# Altium project eye_tracking_wheelchair.PrjPcb
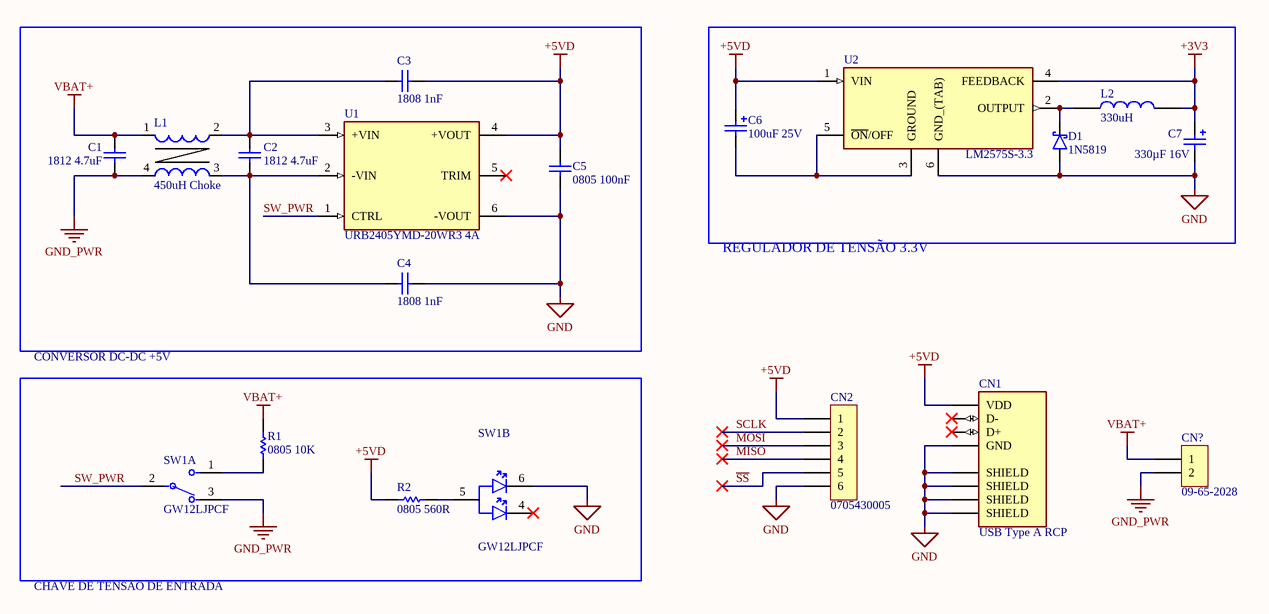
[diagram p0: power_module.SchDoc]
1 sheet, 18 parts. Net scope: global (net labels, ports and power ports of the same name join across sheets).

## Sheet power_module.SchDoc: Módulo de Alimentação
size A4; Engineer: Amós Nunes; Organization: NUTES; SheetNumber: 1; SheetTotal: 1; Tamanho: A4; Equipament: E. T. Wheelchair

### Parts
C1  1812 4.7uF  [CAP1812]
C2  1812 4.7uF  [CAP1812]
C3  1808 1nF  [CAP1808]
C4  1808 1nF  [CAP1808]
C5  0805 100nF  [CAP0805]
C6  100uF 25V  [CAP_PK/PZ_6P3X11_LOW_RUB]
C7  330µF 16V  [CAP_PK/PZ_6P3X11_LOW_RUB]
CN1  USB Type A RCP  [MOLEX_48258-0001]
CN2  0705430005  [FP-0705430005-MFG]
CN?  09-65-2028  [FP-09-65-2028-MFG]
D1  1N5819  [DIOAD1405W86L465D235]
L1  450uH Choke  [WE-CMB-HC-S]
L2  330uH  [CLF7045_*]
R1  0805 10K  [RES0805]
R2  0805 560R  [RES0805]
SW1  GW12LJPCF  [FP-GW12LJPCF-MFG]  (parts A,B of 2)
U1  URB2405YMD-20WR3 4A  [CONV_URB2405YMD-20WR3]
U2  LM2575S-3.3  [TO170P1435X465-6N]

### Blocks framed on the sheet
CONVERSOR DC-DC +5V: R1 R2 SW1

### Nets
+3V3: C7.1 L2.2 U2.4(FEEDBACK)
+5VD: C3.2 C5.1 C6.1 CN1.1(VDD) CN2.1 R2.1 U1.4(+VOUT) U2.1(VIN)
GND: C4.1 C5.2 C7.2 CN1.4(GND) CN1.SH1(SHIELD) CN1.SH2(SHIELD) CN1.SH3(SHIELD) CN1.SH4(SHIELD) CN2.6 D1.2(A) SW1.6(GREEN_C) U1.6(-VOUT) U2.6(GND_(TAB))
GND_PWR: C1.2 CN?.2 L1.4 SW1.3
VBAT+: C1.1 CN?.1 L1.1 R1.1
~{SS}: CN2.5
MISO: CN2.4
MOSI: CN2.3
SCLK: CN2.2
SW_PWR: SW1.2(COM) U1.1(CTRL)
NetC2_1: C2.1 C3.1 L1.2 U1.3(+VIN)
NetC2_2: C2.2 C4.2 L1.3 U1.2(-VIN)
NetC6_2: C6.2 U2.3(GROUND) U2.5(~{ON}/OFF)
NetD1_1: D1.1(K) L2.1 U2.2(OUTPUT)
NetR1_2: R1.2 SW1.1
NetR2_2: R2.2 SW1.5(COMMON_ANODE)

Not connected (* = marked no-connect by the designer): CN1 2(D-)* 3(D+)*; SW1 4(RED_C)*; U1 5(TRIM)*

### Notes on the sheet
- REGULADOR DE TENSÃO 3.3V
- CHAVE DE TENSÃO DE ENTRADA
- Title
- Size:
- Date:
- Equipament:
- Draw By:
- Sheet:
- Board:
- of:
- File:

### Library data of the parts
C1 C2 = C1812C475K5RACAUTO: Cap Ceramic 4.7uF 50V X7R 10% Pad SMD 1812 125C Automotive T/R; Manufacturer: KEMET; Supplier 1: Newark; Manufacturer Part Number: C1812C475K5RACAUTO; RoHS: Yes; Category: Ceramic Capacitors; Stock 1: 5654; Pricing 1: 1=2,33000, 10=2,16000, 25=2,00000, 50=1,83000, 100=1,66000 (USD); Mount: Surface Mount; Case/Package: 1812; Case Code (Metric): 4532; Case Code (Imperial): 1812; Dielectric Material: Ceramic; Min Operating Temperature: -55°C; Max Operating Temperature: 125°C; Package Quantity: 1; Capacitance: 4.7uF; Voltage Rating: 50V; Tolerance: 10%; Packaging: Cut Tape; Voltage Rating (DC): 50V; Series: C; Dielectric: X7R; Length: 0.177inch; Width: 0.126inch; Thickness: 0.071inch; Depth: 3.2mm; Ratings: AEC-Q200; RoHS Compliant: Yes; REACH SVHC: No SVHC; ComponentLink1URL: https://datasheet.ciiva.com/6256/datasheetpn-c1812c475k5racauto-6256279.pdf?src-supplier=Digi-Key; ComponentLink1Description: https://datasheet.ciiva.com/6256/datasheetpn-c1812c475k5racauto-6256279.pdf?src-supplier=Digi-Key; ComponentLink2URL: https://datasheet.ciiva.com/7807/1698758-7807389.pdf?src-supplier=Element14; ComponentLink2Description: https://datasheet.ciiva.com/7807/1698758-7807389.pdf?src-supplier=Element14; Supplier Part Number 1: 86T2696
C3 C4 = C1808C102KGRACTU: 1808 C 1nF Ceramic Multilayer Capacitor; 2000 VDC; +125degC; X7R Dielec; +/-10%; Manufacturer: KEMET; Tolerance: 10%; Voltage Rating: 2kV; Voltage Rating (DC): 2.5kV; Dissipation Factor: 2.5%; Supplier 1: Newark; Manufacturer Part Number: C1808C102KGRACTU; RoHS: Yes; Category: Ceramic Capacitors; Stock 1: 3288; Pricing 1: 1=1,63000, 10=1,16000, 25=1,01000, 50=0,86800, 100=0,72300 (USD); Mount: Surface Mount,PCB; Case/Package: 1808; Number of Pins: 2; Case Code (Metric): 4520; Case Code (Imperial): 1808; Dielectric Material: Ceramic; Min Operating Temperature: -55°C; Max Operating Temperature: 125°C; Dielectric: X7R; Capacitance: 1nF; Package Quantity: 1000; Packaging: Tape and Reel; Termination: SMD/SMT; Voltage: 2kV; Series: C; Length: 4.7mm; Width: 0.079inch; Height: 1.6mm; Thickness: 0.069inch; Depth: 2mm; Radiation Hardening: No; REACH SVHC: No SVHC; RoHS Compliant: Yes; ComponentLink1URL: https://datasheet.ciiva.com/148/docfinderpartnumber-c1808c102kgractu-148948.pdf?src-supplier=Digi-Key; ComponentLink1Description: https://datasheet.ciiva.com/148/docfinderpartnumber-c1808c102kgractu-148948.pdf?src-supplier=Digi-Key; ComponentLink2URL: https://datasheet.ciiva.com/5420/kem-c1010-x7r-hv-smd-5420520.pdf?src-supplier=Mouser; ComponentLink2Description: https://datasheet.ciiva.com/5420/kem-c1010-x7r-hv-smd-5420520.pdf?src-supplier=Mouser; Supplier Part Number 1: 50AC8501
C5 = CC0805KRX7R9BB104: CC Series 0805 0.1 uF 50 V ±10 % Tolerance X7R SMT Multilayer Ceramic Capacitor; Manufacturer: Yageo; Tolerance: 10%; Voltage Rating: 50V; Insulation Resistance: 100GR; Supplier 1: Digi-Key; Manufacturer Part Number: CC0805KRX7R9BB104; RoHS: Yes; Category: Ceramic Capacitors; Stock 1: 7319595; Pricing 1: 4000=0,01864, 8000=0,01734 (USD); Mount: Surface Mount; Case/Package: 0805; Number of Pins: 2; Case Code (Metric): 2012; Case Code (Imperial): 0805; Material: Ceramic; Min Operating Temperature: -55°C; Max Operating Temperature: 125°C; Capacitance: 100nF; Dielectric: X7R; Packaging: Tape and Reel; Package Quantity: 1; Termination: SMD/SMT; Voltage: 50V; Series: CC; Length: 2mm; Width: 0.049inch; Height: 0.85mm; Depth: 1.25mm; Thickness: 0.033inch; Radiation Hardening: No; REACH SVHC: No SVHC; Lead Free: Lead Free; Halogen Free: Halogen Free; RoHS Compliant: Yes; ComponentLink1URL: https://datasheet.ciiva.com/11786/0900766b80d84f1d-11786009.pdf?src-supplier=RSComponents; ComponentLink1Description: https://datasheet.ciiva.com/11786/0900766b80d84f1d-11786009.pdf?src-supplier=RSComponents; ComponentLink2URL: https://datasheet.ciiva.com/155/mlccorderingcode-155929.pdf?src-supplier=Digi-Key; ComponentLink2Description: https://datasheet.ciiva.com/155/mlccorderingcode-155929.pdf?src-supplier=Digi-Key; ComponentLink3URL: https://datasheet.ciiva.com/155/mlccorderingcode-155930.pdf?src-supplier=Digi-Key; ComponentLink3Description: https://datasheet.ciiva.com/155/mlccorderingcode-155930.pdf?src-supplier=Digi-Key; ComponentLink4URL: https://datasheet.ciiva.com/155/mlccorderingcode-155931.pdf?src-supplier=Digi-Key; ComponentLink4Description: https://datasheet.ciiva.com/155/mlccorderingcode-155931.pdf?src-supplier=Digi-Key; ComponentLink5URL: https://datasheet.ciiva.com/11464/upy-gphc-x7r-6-3v-to-50v-8-11464757.pdf?src-supplier=Avnet; ComponentLink5Description: https://datasheet.ciiva.com/11464/upy-gphc-x7r-6-3v-to-50v-8-11464757.pdf?src-supplier=Avnet; ComponentLink6URL: https://datasheet.ciiva.com/16625/upy-gphc-x7r-6-3v-to-50v-8-16625549.pdf?src-supplier=Avnet+Europe; ComponentLink6Description: https://datasheet.ciiva.com/16625/upy-gphc-x7r-6-3v-to-50v-8-16625549.pdf?src-supplier=Avnet+Europe; ComponentLink7URL: https://datasheet.ciiva.com/28450/1489800-28450805.pdf?src-supplier=Element14; ComponentLink7Description: https://datasheet.ciiva.com/28450/1489800-28450805.pdf?src-supplier=Element14; ComponentLink8URL: https://datasheet.ciiva.com/46393/1734573-46393307.pdf?src-supplier=Element14; ComponentLink8Description: https://datasheet.ciiva.com/46393/1734573-46393307.pdf?src-supplier=Element14; ComponentLink9URL: https://datasheet.ciiva.com/29242/445210-da-01-en-kerko-chip-0805-x7r-0-1uf-10proz-50vg-29242074.pdf?src-supplier=Conrad; ComponentLink9Description: https://datasheet.ciiva.com/29242/445210-da-01-en-kerko-chip-0805-x7r-0-1uf-10proz-50vg-29242074.pdf?src-supplier=Conrad; Supplier Part Number 1: 311-1140-2-ND
C6 = 25YXF100MEFC6.3X11: 100 µF 25 V Aluminum Electrolytic Capacitors Radial, Can - 5000 Hrs @ 105°C; Manufacturer_Name: Rubycon; Supplier 1: Digi-Key; Supplier Part Number 1: 1189-1857-ND; MP: 25YXF100MEFC6.3X11
C7 = 16PK330MEFC6.3X11: Cap Aluminum 330uF 16V 20% (6.3 X 11mm) Radial Aluminum Cylindrical Can 2.5mm 360mA 2000 hr 85°C Bulk; Mfr_Name: Rubycon; Type: DEV; Life (Hours): 2000Hour; Leakage Current: 3uA; Lead Diameter: 0.5mm; Copyright: Copyright (C) 2021 Ultra Librarian. All rights reserved.; Manufacturer_Part_Number: 16PK330MEFC6.3X11; Digi-Key_Part_Number_1: 1189-1122-ND; RefDes: RefDes; Supplier 1: Newark; Manufacturer: Rubycon; Manufacturer Part Number: 16PK330MEFC6.3X11; RoHS: Yes; Category: Aluminum Electrolytic Capacitors; Stock 1: 1848; Pricing 1: 1=0,04600, 10=0,04600, 25=0,04600, 50=0,04600, 100=0,04600, 500=0,04600 (USD); Mount: Through Hole; Case/Package: Radial; Number of Pins: 2; Min Operating Temperature: -40°C; Max Operating Temperature: 85°C; Capacitance: 330uF; Tolerance: 20%; Ripple Current: 360mA; Termination: Radial; Voltage Rating: 16V; Ripple Current (AC): 360mA; Package Quantity: 2000; Packaging: Bulk; Voltage: 16V; Voltage Rating (DC): 16V; Series: PK; Construction: RADIAL; Diameter: 6.3mm; Height: 11mm; Lead Pitch: 2.5mm; Height - Seated (Max): 0.492inch; Radiation Hardening: No; REACH SVHC: No SVHC; RoHS Compliant: Yes; ComponentLink1URL: https://datasheet.ciiva.com/25614/0900766b810f8819-25614366.pdf?src-supplier=RSComponents; ComponentLink1Description: https://datasheet.ciiva.com/25614/0900766b810f8819-25614366.pdf?src-supplier=RSComponents; ComponentLink2URL: https://datasheet.ciiva.com/11690/e-pk-11690815.pdf?src-supplier=Avnet; ComponentLink2Description: https://datasheet.ciiva.com/11690/e-pk-11690815.pdf?src-supplier=Avnet; ComponentLink3URL: https://datasheet.ciiva.com/6328/e-pk-6328463.pdf?src-supplier=Digi-Key; ComponentLink3Description: https://datasheet.ciiva.com/6328/e-pk-6328463.pdf?src-supplier=Digi-Key; Supplier Part Number 1: 39T8550
CN1 = 48258-0001: Conn USB Type A RCP 4 POS 2.5mm Solder RA Thru-Hole 4 Terminal 1 Port Embossed T/R; Manufacturer Part Number: 0482580001; MF: Molex; Number of Terminals/Pins: 4; Gender: Receptacle; Number of Ports: 1; Max Voltage Rating (AC): 250V; Value: *; MP: 48258-0001; Package: None; Price: None; SnapEDA_Link: https://www.snapeda.com/parts/48258-0001/Molex/view-part/337624/?ref=snap; Availability: Unavailable; Supplier 1: Newark; Manufacturer: Molex; RoHS: Yes; Category: Headers and Wire Housings; Stock 1: 1047; Pricing 1: 1=1,29000, 10=1,08000, 25=0,99800, 50=0,91400, 100=0,83000 (USD); Mount: Through Hole,Board; Contact Material: Bronze; Contact Plating: Gold,Tin; Housing Material: Polyamide; Min Operating Temperature: -25°C; Max Operating Temperature: 85°C; Packaging: Tape and Reel; Connector Type: USB; Number of Contacts: 4; Termination: Solder; Orientation: Right Angle; Series: 48258; Package Quantity: 1; Length: 17.1mm; Pitch: 2.5mm; Depth: 14mm; ComponentLink1URL: https://datasheet.ciiva.com/851/482580001-sd-851811.pdf?src-supplier=Digi-Key; ComponentLink1Description: https://datasheet.ciiva.com/851/482580001-sd-851811.pdf?src-supplier=Digi-Key; ComponentLink2URL: https://datasheet.ciiva.com/3094/0482580001-io-connectors-3094328.pdf?src-supplier=Avnet; ComponentLink2Description: https://datasheet.ciiva.com/3094/0482580001-io-connectors-3094328.pdf?src-supplier=Avnet; ComponentLink3URL: https://datasheet.ciiva.com/851/482580001-sd-851812.pdf?src-supplier=Digi-Key; ComponentLink3Description: https://datasheet.ciiva.com/851/482580001-sd-851812.pdf?src-supplier=Digi-Key; ComponentLink4URL: https://datasheet.ciiva.com/15181/getdatasheetpartid-434363-15181356.pdf?src-supplier=Verical; ComponentLink4Description: https://datasheet.ciiva.com/15181/getdatasheetpartid-434363-15181356.pdf?src-supplier=Verical; Supplier Part Number 1: 74AC2928
CN2 = 0705430005: Conn Shrouded Header (4 Sides) HDR 6 POS 2.54mm Solder ST Top Entry Thru-Hole SL™ Tube; Manufacturer: Molex; Contact Resistance: 30mR; Number of Positions: 6; Connector Type: Male Pin; Pitch: 0.1inch; Supplier 1: RSComponents; Manufacturer Part Number: 0705430005; RoHS: Yes; Category: Headers and Wire Housings; Stock 1: 440; Pricing 1: 10=1,32100, 200=1,15000, 750=0,92500, 3000=0,75400, 6000=0,73000 (USD); Mount: Through Hole; Contact Plating: Gold; Contact Material: Bronze; Color: Black; Housing Color: Black; Housing Material: Polyester; Min Operating Temperature: -40°C; Max Operating Temperature: 105°C; Packaging: Rail/Tube; Number of Rows: 1; Termination: Solder; Orientation: Straight; Series: C-Grid® SL™ 70543; Contact Type: Male Pin; Length: 17.79mm; Depth: 6.6mm; Contact Mating Length: 0.24inch; Radiation Hardening: No; RoHS Compliant: Yes; ComponentLink1URL: http://components.arrow.com/part/dataview/2934603S3153303N3303?src-supplier=Arrow+Electronics; ComponentLink1Description: http://components.arrow.com/part/dataview/2934603S3153303N3303?src-supplier=Arrow+Electronics; ComponentLink2URL: http://components.arrow.com/part/dataview/0323_00048382?src-supplier=Arrow+Europe; ComponentLink2Description: http://components.arrow.com/part/dataview/0323_00048382?src-supplier=Arrow+Europe; Supplier Part Number 1: 6792483
CN? = 09-65-2028: Manufacturer: MolexProduct Category: Headers & Wire HousingsBrand: MolexProduct: HeadersType: Pin StripNumber of...; Manufacturer: Molex; Number of Contacts: 2; Gender: Male; Contact Resistance: 10mR; Max Voltage Rating (AC): 250V; Current Rating: 7A; Insulation Resistance: 50GR; Pitch: 3.96mm; Supplier 1: RSComponents; Manufacturer Part Number: 09-65-2028; RoHS: Yes; Category: Headers and Wire Housings; Stock 1: 1; Pricing 1: 10=0,29200, 100=0,26200, 250=0,23700, 500=0,21400, 1000=0,19200 (USD); Mount: Through Hole; Contact Plating: Tin,Copper; Contact Material: Brass; Housing Material: Nylon; Housing Color: Natural; Color: Natural; Min Operating Temperature: -40°C; Max Operating Temperature: 105°C; Number of Rows: 1; Termination: Solder; Voltage Rating: 250V; Package Quantity: 12000; Packaging: Bulk; Number of Positions: 2; Orientation: Straight; Voltage Rating (DC): 250V; Fastening Type: Friction; Series: SPOX™ 5273; Contact Type: Male Pin; Contact Mating Length: 0.419inch; Depth: 10.75mm; Radiation Hardening: No; Lead Free: Lead Free; RoHS Compliant: Yes; REACH SVHC: Unknown; Flammability Rating: UL94 V-2; ComponentLink1URL: https://datasheet.ciiva.com/5157/0009652028-pcb-headers-156612-5157782.pdf?src-supplier=Mouser; ComponentLink1Description: https://datasheet.ciiva.com/5157/0009652028-pcb-headers-156612-5157782.pdf?src-supplier=Mouser; ComponentLink2URL: https://datasheet.ciiva.com/11746/0900766b80d59e72-11746663.pdf?src-supplier=RSComponents; ComponentLink2Description: https://datasheet.ciiva.com/11746/0900766b80d59e72-11746663.pdf?src-supplier=RSComponents; ComponentLink3URL: https://datasheet.ciiva.com/30186/71930009652028-pcb-headers-30186738.pdf?src-supplier=Onlinecomponents.com; ComponentLink3Description: https://datasheet.ciiva.com/30186/71930009652028-pcb-headers-30186738.pdf?src-supplier=Onlinecomponents.com; ComponentLink4URL: https://datasheet.ciiva.com/10088/0009652028-pcb-headers-10088443.pdf?src-supplier=Avnet; ComponentLink4Description: https://datasheet.ciiva.com/10088/0009652028-pcb-headers-10088443.pdf?src-supplier=Avnet; ComponentLink5URL: https://datasheet.ciiva.com/15217/getdatasheetpartid-176740-15217269.pdf?src-supplier=Verical; ComponentLink5Description: https://datasheet.ciiva.com/15217/getdatasheetpartid-176740-15217269.pdf?src-supplier=Verical; Supplier Part Number 1: 6705237P
D1 = 1N5819: Schottky Diode, DO-15, 40V, 1.00A; Manufacturer_Name: MDD; Manufacturer: ON Semiconductor / Fairchild; Element Configuration: Single; Peak Non-Repetitive Surge Current: 25A; Forward Voltage: 900mV; Forward Current: 1A; Max Reverse Current: 500uA; Polarity: Standard; Capacitance: 110pF; Max Reverse Leakage Current: 1mA; Datasheet Link: https://datasheet.lcsc.com/szlcsc/1903051130_MDD-Jiangsu-Yutai-Elec-1N5819_C2474.pdf; Manufacturer_Part_Number: 1N5819; Supplier 1: Avnet; Manufacturer Part Number: 1N5819; RoHS: Yes; Category: Schottky Diodes; Mount: Through Hole; Case/Package: DO-41; Number of Pins: 2; Contact Plating: Tin,Matte; Weight: 0.245g; Min Operating Temperature: -65°C; Max Operating Temperature: 125°C; Packaging: Tape and Reel; Package Quantity: 5000; Max Repetitive Reverse Voltage (Vrrm): 40V; Voltage Rating (DC): 40V; Series: -; Average Rectified Current: 1A; Current Rating: 1A; Output Current: 1A; Max Reverse Voltage (DC): 40V; Max Forward Surge Current (Ifsm): 25A; Max Surge Current: 25A; Diameter: 2.72mm; Length: 5.2mm; Width: 2.72mm; Height: 2.72mm; Radiation Hardening: No; RoHS Compliant: Yes; Lead Free: Lead Free; REACH SVHC: No SVHC; ComponentLink1URL: https://datasheet.ciiva.com/34302/1200637-34302074.pdf?src-supplier=Jameco; ComponentLink1Description: https://datasheet.ciiva.com/34302/1200637-34302074.pdf?src-supplier=Jameco; ComponentLink2URL: https://datasheet.ciiva.com/4719/1n5817-d-103200-4719059.pdf?src-supplier=Mouser; ComponentLink2Description: https://datasheet.ciiva.com/4719/1n5817-d-103200-4719059.pdf?src-supplier=Mouser; ComponentLink3URL: https://datasheet.ciiva.com/25951/1n5819-25951350.pdf?src-supplier=Avnet+Europe; ComponentLink3Description: https://datasheet.ciiva.com/25951/1n5819-25951350.pdf?src-supplier=Avnet+Europe; ComponentLink4URL: https://datasheet.ciiva.com/1177/1671052-1177084.pdf?src-supplier=Element14; ComponentLink4Description: https://datasheet.ciiva.com/1177/1671052-1177084.pdf?src-supplier=Element14; ComponentLink5URL: https://datasheet.ciiva.com/8300/1n5819-8300426.pdf?src-supplier=Avnet; ComponentLink5Description: https://datasheet.ciiva.com/8300/1n5819-8300426.pdf?src-supplier=Avnet; ComponentLink6URL: https://datasheet.ciiva.com/22651/1671052-22651942.pdf?src-supplier=Element14; ComponentLink6Description: https://datasheet.ciiva.com/22651/1671052-22651942.pdf?src-supplier=Element14; Supplier Part Number 1: 1N5819
L1 = 7448227005: Choke/Filter, Common Mode, WE-CMB Size S HC . .45mH 6.5A 10mOhm; Manufacturer: Wurth Electronics; Number of Lines: 2; Tolerance: 30%; Resistance: 0.01R; DC Resistance (DCR): 10mR; Test Frequency: 50Hz; Lead Diameter: 1mm; Supplier 1: RSComponents; Manufacturer Part Number: 7448227005; RoHS: Yes; Category: Common Mode Chokes; Stock 1: 1; Pricing 1: 1=7,14100, 10=6,95300, 100=5,27200, 250=5,12400, 500=4,96300 (USD); Mount: Through Hole,Radial; Min Operating Temperature: -40°C; Max Operating Temperature: 125°C; Package Quantity: 80; Packaging: Tray; Inductance: 450uH; Current: 6.5A; Max DC Current: 6.5A; Termination: Radial; Series: WE-CMB HC; Length: 18.5mm; Width: 14.5mm; Height: 22mm; Lead Pitch: 5mm; Depth: 14.5mm; RoHS Compliant: Yes; ComponentLink1URL: https://datasheet.ciiva.com/6216/7448227005-6216296.pdf?src-supplier=Digi-Key; ComponentLink1Description: https://datasheet.ciiva.com/6216/7448227005-6216296.pdf?src-supplier=Digi-Key; ComponentLink2URL: https://datasheet.ciiva.com/11796/0900766b80f88bbf-11796059.pdf?src-supplier=RSComponents; ComponentLink2Description: https://datasheet.ciiva.com/11796/0900766b80f88bbf-11796059.pdf?src-supplier=RSComponents; Supplier Part Number 1: 7362134P
L2 = CLF7045NIT-331M-D: Inductor Power Shielded Wirewound 330uH 20% 100KHz Ferrite 580mA 800mOhm DCR Automotive T/R; Manufacturer_Name: TDK; Saturation Current: 500mA; DC Resistance (DCR): 960mR; Datasheet Link: https://product.tdk.com/system/files/dam/doc/product/inductor/inductor/smd/catalog/inductor_automotive_power_clf7045ni-d_en.pdf; Manufacturer_Part_Number: CLF7045NIT-331M-D; Mouser Part Number: 810-CLF7045NIT331MD; Mouser Price/Stock: https://www.mouser.co.uk/ProductDetail/TDK/CLF7045NIT-331M-D?qs=P8zzrVhehavOPOXOSviaZQ%3D%3D; Arrow Part Number: CLF7045NIT-331M-D; Arrow Price/Stock: https://www.arrow.com/en/products/clf7045nit-331m-d/tdk; Supplier 1: Digi-Key; Manufacturer: TDK; Manufacturer Part Number: CLF7045NIT-331M-D; RoHS: Yes; Category: Fixed Inductors; Stock 1: 29828; Pricing 1: 1=1,24000, 10=1,14800, 25=1,05920, 50=0,88280, 100=0,82980, 250=0,74152, 500=0,63558 (USD); Mount: Surface Mount; Case/Package: Nonstandard; Core Material: Ferrite; Min Operating Temperature: -55°C; Max Operating Temperature: 150°C; Packaging: Cut Tape; Resistor Type: Wirewound; Inductance: 330uH; Current Rating: 580mA; Shielding: Shielded; Test Frequency: 100kHz; RMS Current (Irms): 580mA; Tolerance: 20%; Inductance Tolerance: 20%; Length: 0.291inch; Width: 0.276inch; Height - Seated (Max): 0.189inch; Ratings: AEC-Q200; REACH SVHC: No SVHC; RoHS Compliant: Yes; ComponentLink1URL: https://product.tdk.com/info/en/catalog/datasheets/inductor_automotive_power_clf7045ni-d_en.pdf?ref_disty=digikey&src-supplier=Digi-Key; ComponentLink1Description: https://product.tdk.com/info/en/catalog/datasheets/inductor_automotive_power_clf7045ni-d_en.pdf?ref_disty=digikey&src-supplier=Digi-Key; ComponentLink2URL: https://product.tdk.com/info/en/catalog/datasheets/inductor_automotive_power_clf7045ni-d_en.pdf?src-supplier=Digi-Key; ComponentLink2Description: https://product.tdk.com/info/en/catalog/datasheets/inductor_automotive_power_clf7045ni-d_en.pdf?src-supplier=Digi-Key; Supplier Part Number 1: 445-174182-1-ND
R1 = RC0805FR-0710KL: 10K Omhs 0805 ± 1.00% 0.125W ± 100ppm/℃; Manufacturer: Yageo; Manufacturer Part Number: RC0603FR-0710KL; Tolerance: 1%; Resistance: 10kR; Temperature Coefficient: 100ppm/°C; Voltage Rating: 75V; Voltage Rating (DC): 50V; Power Rating: 100mW; RoHS: Yes; Category: Chip SMD Resistors; Stock 1: 19091268; Pricing 1: 5000=0,00312 (USD); Case/Package: 0603; Number of Pins: 2; Case Code (Imperial): 0603; Case Code (Metric): 1608; Weight: 7.1E-05oz; Size Code: 0603; Min Operating Temperature: -55°C; Max Operating Temperature: 155°C; Resistor Type: Thick Film; Packaging: Tape and Reel; Termination: SMD/SMT; Features: Moisture Resistant; Series: RC; Max Power Dissipation: 100mW; Number of Terminations: 2; Resistance Tolerance: 1%; Construction: Rectangular; Length: 1.6mm; Width: 0.8mm; Height: 0.45mm; Depth: 0.8mm; Lead Pitch: 0.3mm; RoHS Compliant: Yes; REACH SVHC: Unknown; Military Standard: Not; Lead Free: Lead Free; ComponentLink1URL: https://datasheet.ciiva.com/7660/38590-7660789.pdf?src-supplier=Element14; ComponentLink1Description: https://datasheet.ciiva.com/7660/38590-7660789.pdf?src-supplier=Element14; ComponentLink2URL: https://datasheet.ciiva.com/7983/443971-7983596.pdf?src-supplier=Element14; ComponentLink2Description: https://datasheet.ciiva.com/7983/443971-7983596.pdf?src-supplier=Element14; ComponentLink3URL: https://datasheet.ciiva.com/22747/443971-22747519.pdf?src-supplier=Element14; ComponentLink3Description: https://datasheet.ciiva.com/22747/443971-22747519.pdf?src-supplier=Element14; ComponentLink4URL: https://datasheet.ciiva.com/46440/1868787-46440891.pdf?src-supplier=Element14; ComponentLink4Description: https://datasheet.ciiva.com/46440/1868787-46440891.pdf?src-supplier=Element14; ComponentLink5URL: https://datasheet.ciiva.com/7746/1738695-7746239.pdf?src-supplier=Element14; ComponentLink5Description: https://datasheet.ciiva.com/7746/1738695-7746239.pdf?src-supplier=Element14; ComponentLink6URL: https://datasheet.ciiva.com/15189/getdatasheetpartid-409289-15189591.pdf?src-supplier=Verical; ComponentLink6Description: https://datasheet.ciiva.com/15189/getdatasheetpartid-409289-15189591.pdf?src-supplier=Verical; Stock 2: 435000; Pricing 2: 5000=0,00700 (USD); Package Quantity: 1; Technology: THICK FILM; ComponentLink7URL: https://datasheet.ciiva.com/11808/0900766b8106beab-11808151.pdf?src-supplier=RSComponents; ComponentLink7Description: https://datasheet.ciiva.com/11808/0900766b8106beab-11808151.pdf?src-supplier=RSComponents; ComponentLink8URL: https://datasheet.ciiva.com/46447/444164-46447563.pdf?src-supplier=Element14; ComponentLink8Description: https://datasheet.ciiva.com/46447/444164-46447563.pdf?src-supplier=Element14; ComponentLink9URL: https://datasheet.ciiva.com/2456/pyu-r-int-thick-7-2456973.pdf?src-supplier=Digi-Key; ComponentLink9Description: https://datasheet.ciiva.com/2456/pyu-r-int-thick-7-2456973.pdf?src-supplier=Digi-Key; ComponentLink10URL: https://datasheet.ciiva.com/2456/pyu-r-int-thick-7-2456974.pdf?src-supplier=Digi-Key; ComponentLink10Description: https://datasheet.ciiva.com/2456/pyu-r-int-thick-7-2456974.pdf?src-supplier=Digi-Key; ComponentLink11URL: https://datasheet.ciiva.com/2456/pyu-r-int-thick-7-2456972.pdf?src-supplier=Digi-Key; ComponentLink11Description: https://datasheet.ciiva.com/2456/pyu-r-int-thick-7-2456972.pdf?src-supplier=Digi-Key; ComponentLink12URL: https://datasheet.ciiva.com/12669/rc0805-12669688.pdf?src-supplier=Mouser; ComponentLink12Description: https://datasheet.ciiva.com/12669/rc0805-12669688.pdf?src-supplier=Mouser; ComponentLink13URL: https://datasheet.ciiva.com/16747/rc0805-16747087.pdf?src-supplier=Future+Electronics; ComponentLink13Description: https://datasheet.ciiva.com/16747/rc0805-16747087.pdf?src-supplier=Future+Electronics; Supplier 1: RSComponents; Supplier Part Number 1: 6185163
R2 = RC0805FR-07560RL: 560 Ohm 0805 ± 1.00% 0.125W ± 100ppm/℃; Manufacturer: Yageo; Manufacturer Part Number: RC0603FR-07560RL; Tolerance: 1%; Temperature Coefficient: 100ppm/°C; Voltage Rating (DC): 50V; Power Rating: 100mW; Voltage Rating: 75V; RoHS: Yes; Category: Chip SMD Resistors; Stock 1: 650612; Pricing 1: 1=0,10000, 10=0,02400, 100=0,00970, 1000=0,00436, 2500=0,00378 (USD); Case/Package: 0603; Number of Pins: 2; Case Code (Imperial): 0603; Case Code (Metric): 1608; Weight: 7.1E-05oz; Min Operating Temperature: -55°C; Max Operating Temperature: 155°C; Resistance: 560R; Resistor Type: Thick Film; Packaging: Tape and Reel; Package Quantity: 5000; Termination: SMD/SMT; Number of Terminations: 2; Max Power Dissipation: 100mW; Working Voltage: 75V; Features: Moisture Resistant; Series: RC; Construction: Rectangular; Resistance Tolerance: 1%; Technology: THICK FILM; Length: 1.6mm; Width: 0.8mm; Height: 0.45mm; Depth: 0.8mm; REACH SVHC: No SVHC; Lead Free: Lead Free; Military Standard: Not; RoHS Compliant: Yes; ComponentLink1URL: https://datasheet.ciiva.com/11808/0900766b80f96399-11808127.pdf?src-supplier=RSComponents; ComponentLink1Description: https://datasheet.ciiva.com/11808/0900766b80f96399-11808127.pdf?src-supplier=RSComponents; ComponentLink2URL: https://datasheet.ciiva.com/2454/pyu-r-int-thick-7-2454381.pdf?src-supplier=Digi-Key; ComponentLink2Description: https://datasheet.ciiva.com/2454/pyu-r-int-thick-7-2454381.pdf?src-supplier=Digi-Key; ComponentLink3URL: https://datasheet.ciiva.com/2454/pyu-r-int-thick-7-2454382.pdf?src-supplier=Digi-Key; ComponentLink3Description: https://datasheet.ciiva.com/2454/pyu-r-int-thick-7-2454382.pdf?src-supplier=Digi-Key; ComponentLink4URL: https://datasheet.ciiva.com/2454/pyu-r-int-thick-7-2454383.pdf?src-supplier=Digi-Key; ComponentLink4Description: https://datasheet.ciiva.com/2454/pyu-r-int-thick-7-2454383.pdf?src-supplier=Digi-Key; ComponentLink5URL: https://datasheet.ciiva.com/7746/443971-7746374.pdf?src-supplier=Element14; ComponentLink5Description: https://datasheet.ciiva.com/7746/443971-7746374.pdf?src-supplier=Element14; ComponentLink6URL: https://datasheet.ciiva.com/7746/443971-7746375.pdf?src-supplier=Element14; ComponentLink6Description: https://datasheet.ciiva.com/7746/443971-7746375.pdf?src-supplier=Element14; ComponentLink7URL: https://datasheet.ciiva.com/46412/443971-46412853.pdf?src-supplier=Element14; ComponentLink7Description: https://datasheet.ciiva.com/46412/443971-46412853.pdf?src-supplier=Element14; Stock 2: 3800; Pricing 2: 5000=0,00300 (GBP); Size Code: 0805; ComponentLink8URL: https://datasheet.ciiva.com/2457/pyu-r-int-thick-7-2457141.pdf?src-supplier=Digi-Key; ComponentLink8Description: https://datasheet.ciiva.com/2457/pyu-r-int-thick-7-2457141.pdf?src-supplier=Digi-Key; ComponentLink9URL: https://datasheet.ciiva.com/2457/pyu-r-int-thick-7-2457142.pdf?src-supplier=Digi-Key; ComponentLink9Description: https://datasheet.ciiva.com/2457/pyu-r-int-thick-7-2457142.pdf?src-supplier=Digi-Key; ComponentLink10URL: https://datasheet.ciiva.com/2457/pyu-r-int-thick-7-2457140.pdf?src-supplier=Digi-Key; ComponentLink10Description: https://datasheet.ciiva.com/2457/pyu-r-int-thick-7-2457140.pdf?src-supplier=Digi-Key; ComponentLink11URL: https://datasheet.ciiva.com/5561/rc0805-5561861.pdf?src-supplier=Mouser; ComponentLink11Description: https://datasheet.ciiva.com/5561/rc0805-5561861.pdf?src-supplier=Mouser; ComponentLink12URL: https://datasheet.ciiva.com/7941/444164-7941814.pdf?src-supplier=Element14; ComponentLink12Description: https://datasheet.ciiva.com/7941/444164-7941814.pdf?src-supplier=Element14; ComponentLink13URL: https://datasheet.ciiva.com/7941/444164-7941813.pdf?src-supplier=Element14; ComponentLink13Description: https://datasheet.ciiva.com/7941/444164-7941813.pdf?src-supplier=Element14; Supplier 1: RSComponents; Supplier Part Number 1: 1995727
SW1 = GW12LJPCF: Switch Rocker ON None ON SPDT PC Pins Paddle Rocker 0.1A 28VAC 28VDC 0.4VA 50000Cycles; Manufacturer: NKK; Operating Force: 1N; Contact Resistance: 80mΩ; Voltage Rating (AC): 28V; Power Rating: 400mW; Illumination Color: Green,Red; Illumination Type: LED,Illuminated; Switch Function: On-On; Digikey Description: SWITCH ROCKER SPDT 0.4VA 28V; Device Class L2: Switches; Octopart: https://octopart.com/gw12ljpcf-nkk+switches-1062348; RoHS: TRUE; Package: GW12LJPCF; Throw Configuration: SPDT; ComponentLink2Description: Datasheet; Temperature Range Low: -25°C; Temperature: -25°C to +55°C; Device Class L1: Electromechanical; Height: 10.8mm; Device Class L3: Rocker Switches; Temperature Range High: +55°C; ComponentLink2URL: http://www.nkkswitches.com/pdf/gwillum.pdf; Contact Current Rating: 0.1A; Ambient Temperature Range Low: -25°C; Mouser Description: Illuminated Rocker Switches SPDT ON-ON 0.4VA RED/GRN STRAIGHT PC; Lead Free: Yes; Electromechanical Life: 50000Cycles; Mount: Through Hole; Ipc Land Pattern Name: CAPAD1016W80L630D240; Automotive: No; Category: Switch; Ambient Temperature Range High: +55°C; Manufacturer Part Number: GW12LJPCF; Supplier 1: Digi-Key; Stock 1: 145; Pricing 1: 1=7,14000, 10=6,43200, 25=6,10840, 40=5,85000, 100=5,65600, 300=5,36513, 500=4,91264, 1000=4,68640 (USD); Contact Plating: Gold; Color: Green,Red; Mechanical Life: 50000Cycles; Min Operating Temperature: -25°C; Max Operating Temperature: 55°C; Package Quantity: 1; Voltage Rating (DC): 28V; Termination: PC Pin; Packaging: Tray; Electrical Life: 50000Cycles; Series: GW; REACH SVHC: No SVHC; RoHS Compliant: Yes; ComponentLink1URL: https://datasheet.ciiva.com/2882/gwillum-2882939.pdf?src-supplier=Digi-Key; ComponentLink1Description: https://datasheet.ciiva.com/2882/gwillum-2882939.pdf?src-supplier=Digi-Key; Supplier Part Number 1: 360-2112-ND
U1 = URB2405YMD-20WR3: Module DC-DC 24VIN 1-OUT 5V 4A 20W 6-Pin EPE; Manufacturer: MORNSUN; MF: Mornsun America, LLC; Package: CUSTOM-6 MORNSUN; Availability: In Stock; Check_prices: https://www.snapeda.com/parts/URB2405YMD-20WR3/MORNSUN/view-part/5823817/?ref=eda; Value: *; MP: URB2405YMD-20WR3; SnapEDA_Link: https://www.snapeda.com/parts/URB2405YMD-20WR3/MORNSUN/view-part/5823817/?ref=snap; Price: None; Supplier 1: Digi-Key; Manufacturer Part Number: URB2405YMD-20WR3; RoHS: Yes; Category: Board Mount Modules; Stock 1: 346; Pricing 1: 1=22,83000, 5=22,48800, 10=22,15100, 25=21,51000, 50=20,48620, 100=19,89000, 250=19,30504, 500=18,67508 (USD); Supplier Part Number 1: 2725-URB2405YMD-20WR3-ND
U2 = LM2575S-3.3: SIMPLE SWITCHE 1A Step-Down Voltage egulator 5-DDPAK/TO-263 -40 to 125; Manufacturer_Name: Texas Instruments; Manufacturer_Part_Number: LM2575S-3.3/NOPB; Manufacturer: TI National Semiconductor; Output Voltage: 3.3V; Number of Outputs: 1; Switching Frequency: 58kHz; Max Input Voltage: 40V; Min Input Voltage: 4V; Quiescent Current: 10mA; Frequency: 52kHz; Efficiency: 75%; Synchronous Rectifier: No; Output Type: Fixed; Output Configuration: Positive; Datasheet Link: http://docs-emea.rs-online.com/webdocs/0655/0900766b8065595f.pdf; Height: 4.65mm; Mouser Part Number: 926-LM2575S-3.3/NOPB; Mouser Price/Stock: https://www.mouser.co.uk/ProductDetail/Texas-Instruments/LM2575S-33-NOPB?qs=X1J7HmVL2ZGH5uY2hHZLXw%3D%3D; Arrow Part Number: LM2575S-3.3/NOPB; Arrow Price/Stock: https://www.arrow.com/en/products/lm2575s-3.3nopb/texas-instruments; Supplier 1: Digi-Key; Manufacturer Part Number: LM2575S-3.3; RoHS: No; Category: Voltage Regulators - Switching; Pricing 1: 135=4,89881 (USD); Mount: Surface Mount; Case/Package: TO-263-5; Number of Pins: 5; Min Operating Temperature: -40°C; Max Operating Temperature: 125°C; Output Current: 1A; Packaging: Rail/Tube; Max Output Current: 1A; Package Quantity: 45; Min Output Voltage: 3.3V; Nominal Output Voltage: 3.3V; Series: SIMPLE SWITCHER®; Max Supply Voltage: 40V; Min Supply Voltage: 4V; Max Output Voltage: 3.3V; Termination: SMD/SMT; Radiation Hardening: No; REACH SVHC: No SVHC; Lead Free: Contains Lead; RoHS Compliant: No; ComponentLink1URL: https://datasheet.ciiva.com/18552/lm1575-18552923.pdf?src-supplier=Digi-Key; ComponentLink1Description: https://datasheet.ciiva.com/18552/lm1575-18552923.pdf?src-supplier=Digi-Key; ComponentLink2URL: https://datasheet.ciiva.com/7994/1896099-7994175.pdf?src-supplier=Element14; ComponentLink2Description: https://datasheet.ciiva.com/7994/1896099-7994175.pdf?src-supplier=Element14; Supplier Part Number 1: 296-36374-5-ND